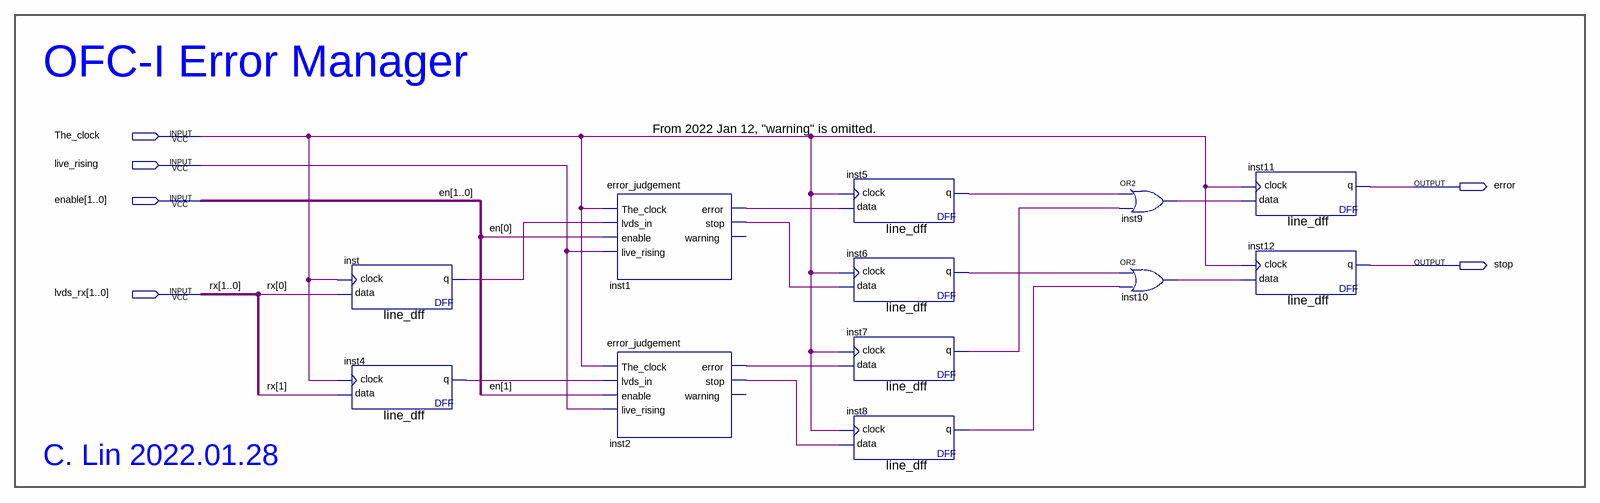
[diagram p0: schematic sheet]
// Quartus schematic ofc1_err_manager.bdf as structural Verilog: 12 symbols, 6 pins
module ofc1_err_manager (
  input  The_clock,
  input  live_rising,
  input  [1:0] enable,
  input  [1:0] lvds_rx,
  output error,
  output stop
);

  wire inst1_error, inst1_stop, inst2_error, inst2_stop, inst4_q, inst5_q, inst6_q, inst7_q, inst8_q,
       inst9_out, inst10_out, inst_q;

  line_dff inst (.data(lvds_rx[0]), .clock(The_clock), .q(inst_q));
  line_dff inst4 (.data(lvds_rx[1]), .clock(The_clock), .q(inst4_q));
  error_judgement inst1 (
    .The_clock(The_clock), .lvds_in(inst_q), .enable(enable[0]), .live_rising(live_rising),
    .error(inst1_error), .stop(inst1_stop));  // open: warning
  error_judgement inst2 (
    .The_clock(The_clock), .lvds_in(inst4_q), .enable(enable[1]), .live_rising(live_rising),
    .error(inst2_error), .stop(inst2_stop));  // open: warning
  line_dff inst5 (.data(inst1_error), .clock(The_clock), .q(inst5_q));
  line_dff inst6 (.data(inst1_stop), .clock(The_clock), .q(inst6_q));
  line_dff inst7 (.data(inst2_error), .clock(The_clock), .q(inst7_q));
  line_dff inst8 (.data(inst2_stop), .clock(The_clock), .q(inst8_q));
  or inst9 (inst9_out, inst5_q, inst7_q);
  or inst10 (inst10_out, inst6_q, inst8_q);
  line_dff inst11 (.data(inst9_out), .clock(The_clock), .q(error));
  line_dff inst12 (.data(inst10_out), .clock(The_clock), .q(stop));

  // Other names for the same wires on the sheet: en[1:0] = enable; rx[1:0] = lvds_rx

  // Notes on the sheet:
  //   OFC-I Error Manager
  //   From 2022 Jan 12, "warning" is omitted.
  //   C. Lin 2022.01.28
endmodule
